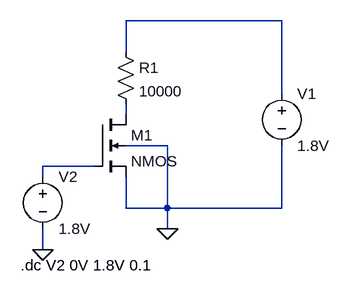
[diagram p0: schematic 1Schematic.asc]
1Schematic.asc, the LTspice schematic file:
Version 4
SHEET 1 880 680
WIRE 480 -48 240 -48
WIRE 240 0 240 -48
WIRE 480 64 480 -48
WIRE 240 96 240 80
WIRE 304 144 240 144
WIRE 192 176 112 176
WIRE 112 192 112 176
WIRE 240 240 240 192
WIRE 304 240 304 144
WIRE 304 240 240 240
WIRE 480 240 480 144
WIRE 480 240 304 240
WIRE 304 272 304 240
WIRE 112 304 112 272
FLAG 112 304 0
FLAG 304 272 0
SYMBOL nmos4 192 96 R0
SYMATTR InstName M1
SYMATTR Value2 l=180 w=270
SYMBOL voltage 480 48 R0
WINDOW 123 0 0 Left 0
WINDOW 39 0 0 Left 0
SYMATTR InstName V1
SYMATTR Value 1.8V
SYMBOL voltage 112 176 R0
WINDOW 123 0 0 Left 0
WINDOW 39 0 0 Left 0
SYMATTR InstName V2
SYMATTR Value 1.8V
SYMBOL res 224 -16 R0
SYMATTR InstName R1
SYMATTR Value 10000
TEXT 78 328 Left 2 !.dc V2 0V 1.8V 0.1

The netlist it stands for:
* 1Schematic.asc
M1 N002 N003 0 0 NMOS l=180 w=270
V1 N001 0 1.8V
V2 N003 0 1.8V
R1 N001 N002 10000
.model NMOS NMOS
.model PMOS PMOS
.lib standard.mos
.dc V2 0V 1.8V 0.1
.backanno
.end